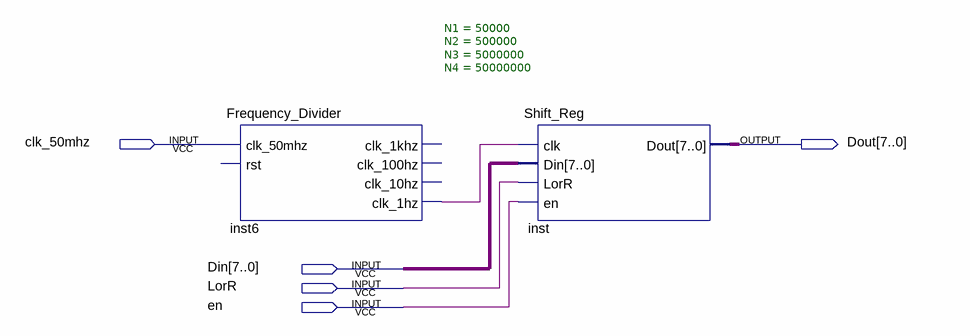
[diagram p0: schematic sheet]
// Quartus schematic block.bdf as structural Verilog: 2 symbols, 5 pins
module block (
  input  clk_50mhz,
  input  [7:0] Din,
  input  LorR,
  input  en,
  output [7:0] Dout
);

  wire inst6_clk_1hz;

  Frequency_Divider #(.N1(50000), .N2(500000), .N3(5000000), .N4(50000000)) inst6 (
    .clk_50mhz(clk_50mhz), .clk_1hz(inst6_clk_1hz));  // open: rst, clk_1khz, clk_100hz, clk_10hz
  Shift_Reg inst (.clk(inst6_clk_1hz), .Din(Din), .LorR(LorR), .en(en), .Dout(Dout));
endmodule
